# EasyEDA schematic SCH_TH RGB LED Stick_2022-05-16.json
TITLE: Sheet_1; REV: 1.0; Date: 2021-12-29; Sheet: 1/1; Drawn By: limchengwei; Company: Your Company
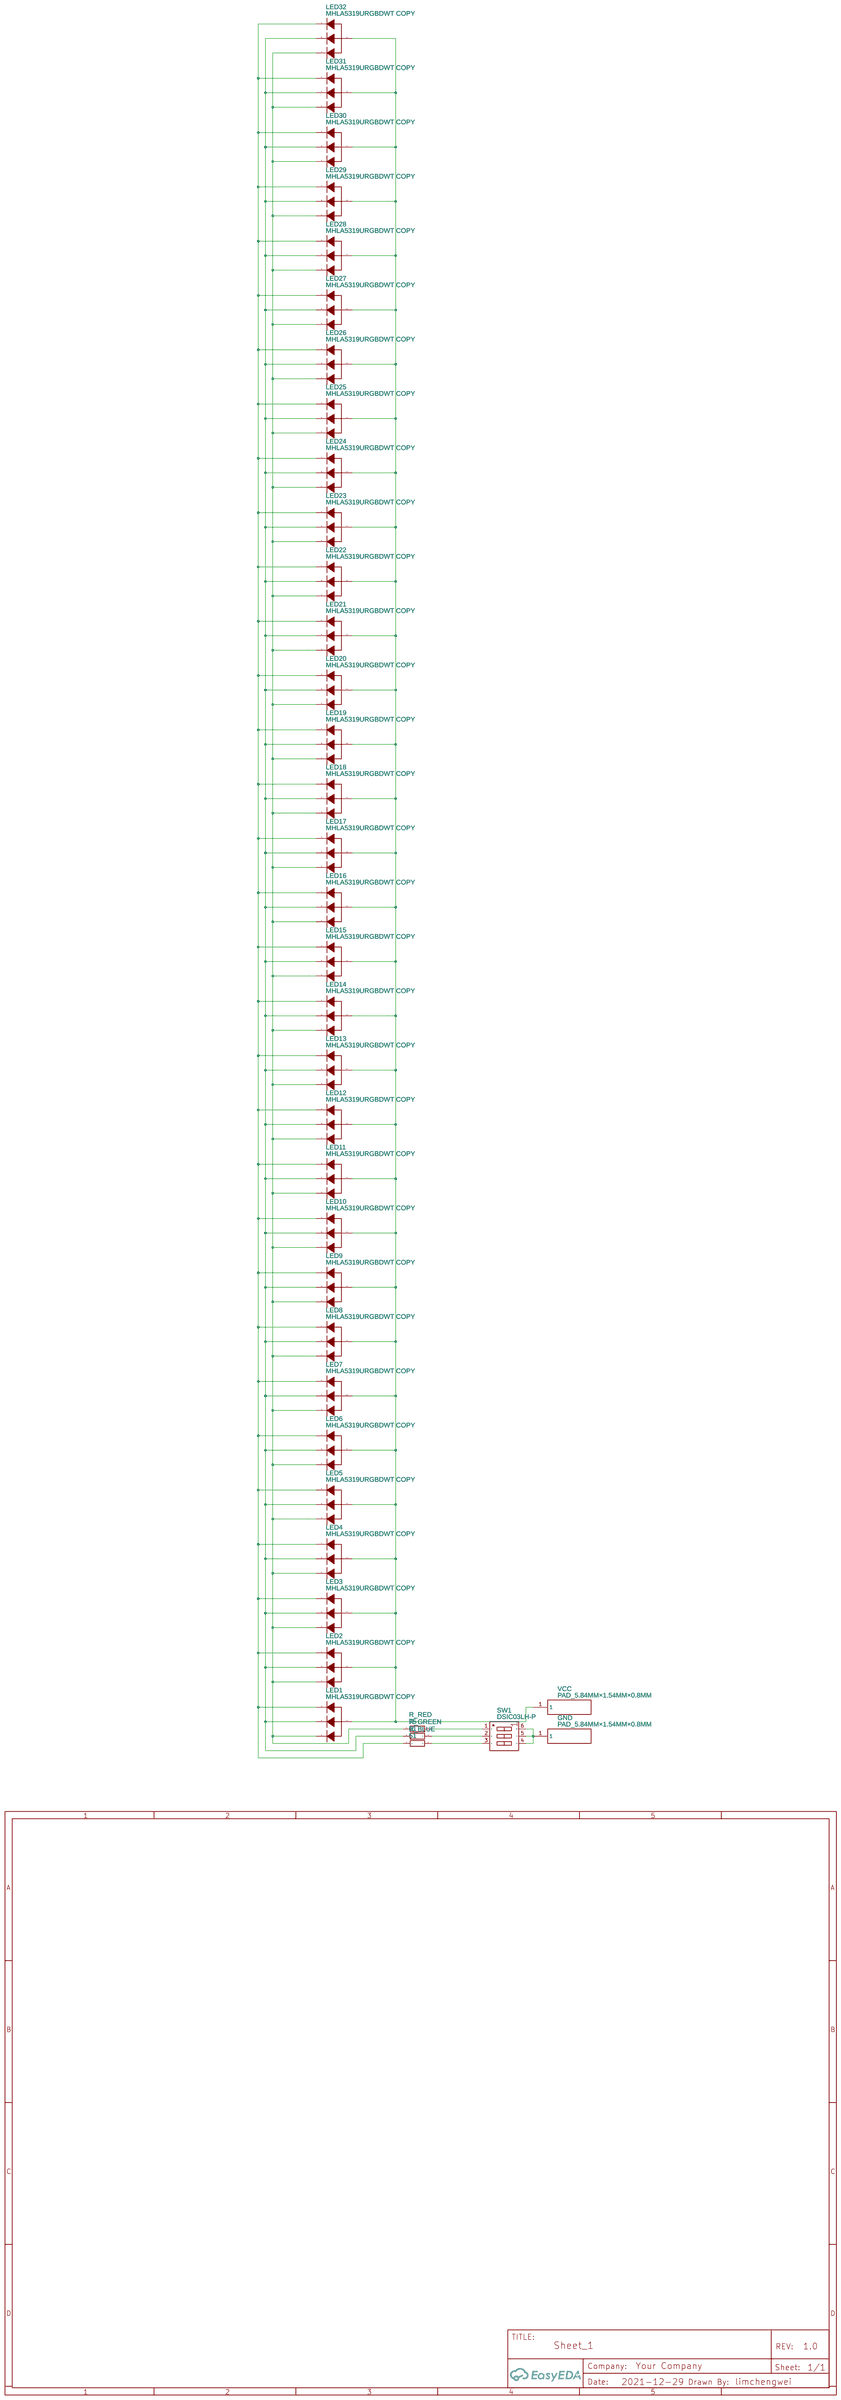
[diagram p0: schematic sheet]

## Parts
GND  PAD_5.84MM×1.54MM×0.8MM  [TESTPOINT-SMD_PAD_5.84MM-1.54MM-0.8MM]
LED1  MHLA5319URGBDWT COPY  [LED-TH_4P-BD6.9-P1.27-R]
LED2  MHLA5319URGBDWT COPY  [LED-TH_4P-BD6.9-P1.27-R]
LED3  MHLA5319URGBDWT COPY  [LED-TH_4P-BD6.9-P1.27-R]
LED4  MHLA5319URGBDWT COPY  [LED-TH_4P-BD6.9-P1.27-R]
LED5  MHLA5319URGBDWT COPY  [LED-TH_4P-BD6.9-P1.27-R]
LED6  MHLA5319URGBDWT COPY  [LED-TH_4P-BD6.9-P1.27-R]
LED7  MHLA5319URGBDWT COPY  [LED-TH_4P-BD6.9-P1.27-R]
LED8  MHLA5319URGBDWT COPY  [LED-TH_4P-BD6.9-P1.27-R]
LED9  MHLA5319URGBDWT COPY  [LED-TH_4P-BD6.9-P1.27-R]
LED10  MHLA5319URGBDWT COPY  [LED-TH_4P-BD6.9-P1.27-R]
LED11  MHLA5319URGBDWT COPY  [LED-TH_4P-BD6.9-P1.27-R]
LED12  MHLA5319URGBDWT COPY  [LED-TH_4P-BD6.9-P1.27-R]
LED13  MHLA5319URGBDWT COPY  [LED-TH_4P-BD6.9-P1.27-R]
LED14  MHLA5319URGBDWT COPY  [LED-TH_4P-BD6.9-P1.27-R]
LED15  MHLA5319URGBDWT COPY  [LED-TH_4P-BD6.9-P1.27-R]
LED16  MHLA5319URGBDWT COPY  [LED-TH_4P-BD6.9-P1.27-R]
LED17  MHLA5319URGBDWT COPY  [LED-TH_4P-BD6.9-P1.27-R]
LED18  MHLA5319URGBDWT COPY  [LED-TH_4P-BD6.9-P1.27-R]
LED19  MHLA5319URGBDWT COPY  [LED-TH_4P-BD6.9-P1.27-R]
LED20  MHLA5319URGBDWT COPY  [LED-TH_4P-BD6.9-P1.27-R]
LED21  MHLA5319URGBDWT COPY  [LED-TH_4P-BD6.9-P1.27-R]
LED22  MHLA5319URGBDWT COPY  [LED-TH_4P-BD6.9-P1.27-R]
LED23  MHLA5319URGBDWT COPY  [LED-TH_4P-BD6.9-P1.27-R]
LED24  MHLA5319URGBDWT COPY  [LED-TH_4P-BD6.9-P1.27-R]
LED25  MHLA5319URGBDWT COPY  [LED-TH_4P-BD6.9-P1.27-R]
LED26  MHLA5319URGBDWT COPY  [LED-TH_4P-BD6.9-P1.27-R]
LED27  MHLA5319URGBDWT COPY  [LED-TH_4P-BD6.9-P1.27-R]
LED28  MHLA5319URGBDWT COPY  [LED-TH_4P-BD6.9-P1.27-R]
LED29  MHLA5319URGBDWT COPY  [LED-TH_4P-BD6.9-P1.27-R]
LED30  MHLA5319URGBDWT COPY  [LED-TH_4P-BD6.9-P1.27-R]
LED31  MHLA5319URGBDWT COPY  [LED-TH_4P-BD6.9-P1.27-R]
LED32  MHLA5319URGBDWT COPY  [LED-TH_4P-BD6.9-P1.27-R]
R_BLUE  51  [RES-TH_BD2.3-L6.5-P10.50-D0.5]
R_GREEN  51  [RES-TH_BD2.3-L6.5-P10.50-D0.5]
R_RED  75  [RES-TH_BD2.3-L6.5-P10.50-D0.5]
SW1  DSIC03LH-P  [SW-TH_6P-L7.5-W6.0-P2.54-LS7.6]
VCC  PAD_5.84MM×1.54MM×0.8MM  [TESTPOINT-SMD_PAD_5.84MM-1.54MM-0.8MM]

## Library data of the parts
GND VCC = PAD_5.84MM×1.54MM×0.8MM: Supplier: LCSC; Supplier Part: C9900000335; Manufacturer Part: PAD_5.84mm×1.54mm×0.8mm; JLCPCB Part Class: Extended Part; Contributor: LCSC
LED1-LED32 = MHLA5319URGBDWT COPY: Supplier: LCSC; Supplier Part: C417349; Manufacturer: MEIHUA; Manufacturer Part: MHLA5319URGBDWT; Contributor: LCSC; JLCPCB Part Class: Extended Part
R_BLUE R_GREEN R_RED = MF1/4W-620Ω±1% T52: Supplier: LCSC; Supplier Part: C119319; Manufacturer: Chian Chia Elec; Contributor: LCSC
SW1 = DSIC03LH-P: Supplier: LCSC; Supplier Part: C319041; Manufacturer: XKB Enterprise; Contributor: LCSC; JLCPCB Part Class: Extended Part

## Nets
Net-(GND-1): GND.1 SW1.4(PIN4) SW1.5(PIN5) SW1.6(PIN6)
Net-(LED1-1): LED1.1(-) LED2.1(-) LED3.1(-) LED4.1(-) LED5.1(-) LED6.1(-) LED7.1(-) LED8.1(-) LED9.1(-) LED10.1(-) LED11.1(-) LED12.1(-) LED13.1(-) LED14.1(-) LED15.1(-) LED16.1(-) LED17.1(-) LED18.1(-) LED19.1(-) LED20.1(-) LED21.1(-) LED22.1(-) LED23.1(-) LED24.1(-) LED25.1(-) LED26.1(-) LED27.1(-) LED28.1(-) LED29.1(-) LED30.1(-) LED31.1(-) LED32.1(-) R_RED.2
Net-(LED1-2): LED1.2(+) LED2.2(+) LED3.2(+) LED4.2(+) LED5.2(+) LED6.2(+) LED7.2(+) LED8.2(+) LED9.2(+) LED10.2(+) LED11.2(+) LED12.2(+) LED13.2(+) LED14.2(+) LED15.2(+) LED16.2(+) LED17.2(+) LED18.2(+) LED19.2(+) LED20.2(+) LED21.2(+) LED22.2(+) LED23.2(+) LED24.2(+) LED25.2(+) LED26.2(+) LED27.2(+) LED28.2(+) LED29.2(+) LED30.2(+) LED31.2(+) LED32.2(+) VCC.1
Net-(LED1-3): LED1.3(-) LED2.3(-) LED3.3(-) LED4.3(-) LED5.3(-) LED6.3(-) LED7.3(-) LED8.3(-) LED9.3(-) LED10.3(-) LED11.3(-) LED12.3(-) LED13.3(-) LED14.3(-) LED15.3(-) LED16.3(-) LED17.3(-) LED18.3(-) LED19.3(-) LED20.3(-) LED21.3(-) LED22.3(-) LED23.3(-) LED24.3(-) LED25.3(-) LED26.3(-) LED27.3(-) LED28.3(-) LED29.3(-) LED30.3(-) LED31.3(-) LED32.3(-) R_GREEN.2
Net-(LED1-4): LED1.4(-) LED2.4(-) LED3.4(-) LED4.4(-) LED5.4(-) LED6.4(-) LED7.4(-) LED8.4(-) LED9.4(-) LED10.4(-) LED11.4(-) LED12.4(-) LED13.4(-) LED14.4(-) LED15.4(-) LED16.4(-) LED17.4(-) LED18.4(-) LED19.4(-) LED20.4(-) LED21.4(-) LED22.4(-) LED23.4(-) LED24.4(-) LED25.4(-) LED26.4(-) LED27.4(-) LED28.4(-) LED29.4(-) LED30.4(-) LED31.4(-) LED32.4(-) R_BLUE.2
Net-(R_BLUE-1): R_BLUE.1 SW1.3(PIN3)
Net-(R_GREEN-1): R_GREEN.1 SW1.2(PIN2)
Net-(R_RED-1): R_RED.1 SW1.1(PIN1)
